# Altium schematic sheet expansion_in.SchDoc
size A
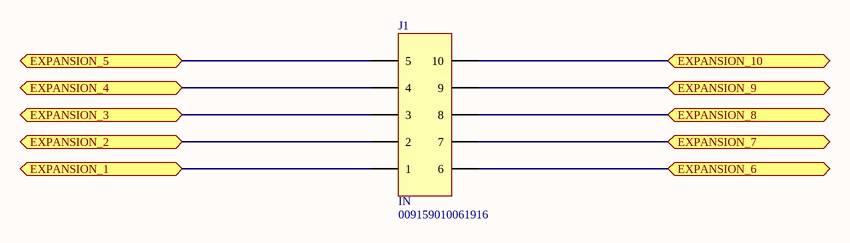
[diagram p0: expansion_in.SchDoc]

## Parts
J1  IN  [009159010061916_BACK]

## Ports
EXPANSION_1, EXPANSION_2, EXPANSION_3, EXPANSION_4, EXPANSION_5, EXPANSION_6, EXPANSION_7, EXPANSION_8, EXPANSION_9, EXPANSION_10

## Nets
EXPANSION_1: J1.1 ; port EXPANSION_1
EXPANSION_2: J1.2 ; port EXPANSION_2
EXPANSION_3: J1.3 ; port EXPANSION_3
EXPANSION_4: J1.4 ; port EXPANSION_4
EXPANSION_5: J1.5 ; port EXPANSION_5
EXPANSION_6: J1.6 ; port EXPANSION_6
EXPANSION_7: J1.7 ; port EXPANSION_7
EXPANSION_8: J1.8 ; port EXPANSION_8
EXPANSION_9: J1.9 ; port EXPANSION_9
EXPANSION_10: J1.10 ; port EXPANSION_10

## Library data of the parts
J1 = 009159010061916: CONN SSL BRIDGE 10POS 2MM Open Ended Card Edge: 00-9159; MANUFACTURER: AVX Corporation; VALIDATED BY: NV; DISTRIBUTOR: DIGI-KEY; DISTRIBUTOR P/N: 478-8659-ND; CREATED BY: SO 7 2014; COST: 1.06; MANUFACTURER P/N: 009159010061916